# Altium schematic sheet Ethernet.SchDoc
size A2
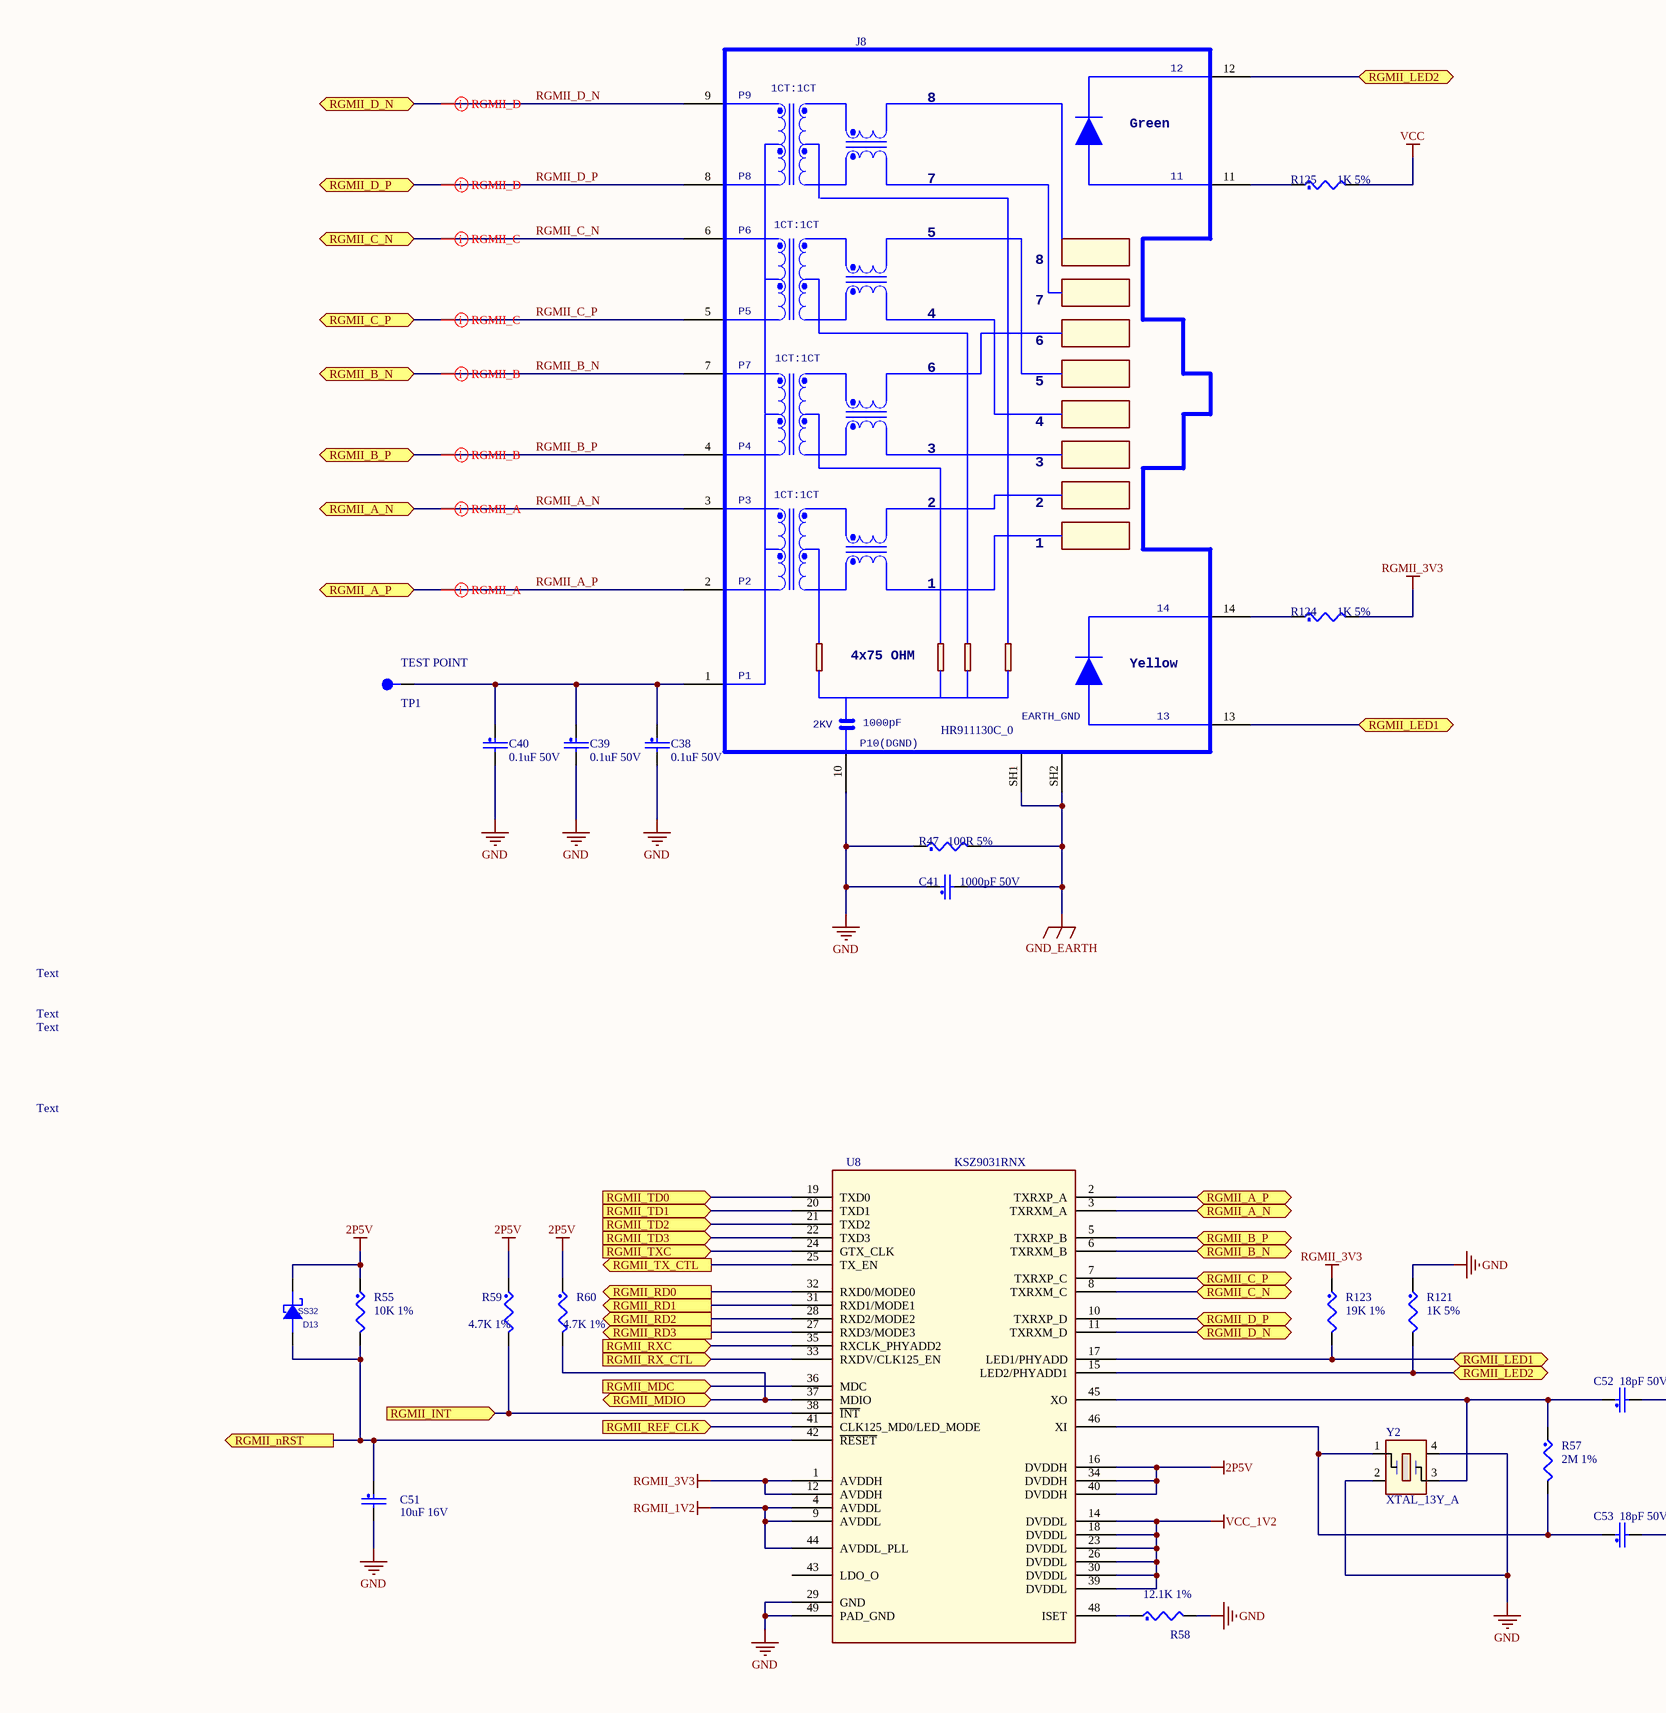
[diagram p0: Ethernet.SchDoc, left]
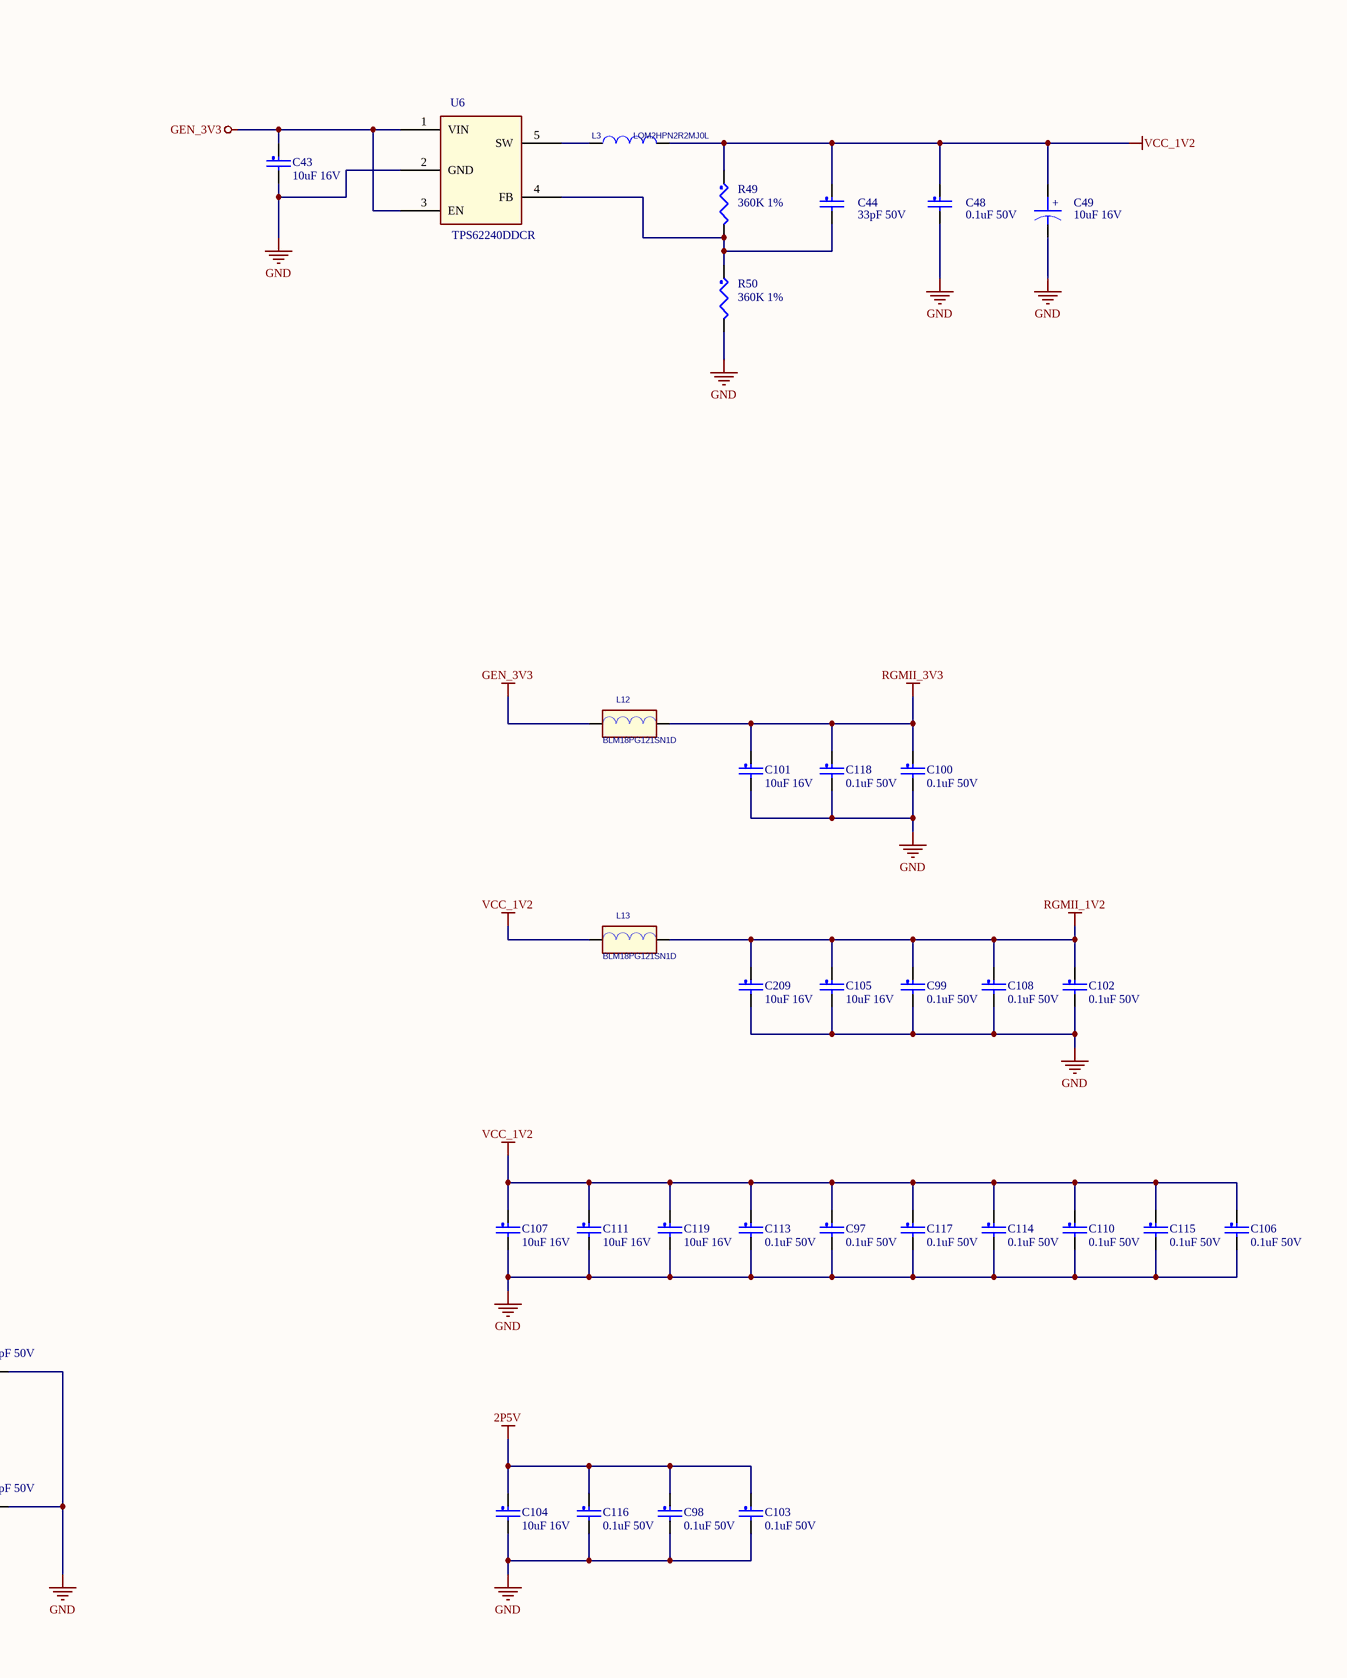
[diagram p1: Ethernet.SchDoc, right]

## Parts
C38  0.1uF 50V  [SC0603]
C39  0.1uF 50V  [SC0603]
C40  0.1uF 50V  [SC0603]
C41  1000pF 50V  [SC0603]
C43  10uF 16V  [SC0805]
C44  33pF 50V  [SC0603]
C48  0.1uF 50V  [SC0603]
C49  10uF 16V  [SC0805]
C51  10uF 16V  [SC0805]
C52  18pF 50V  [SC0603]
C53  18pF 50V  [SC0603]
C97  0.1uF 50V  [SC0603]
C98  0.1uF 50V  [SC0603]
C99  0.1uF 50V  [SC0603]
C100  0.1uF 50V  [SC0603]
C101  10uF 16V  [SC0805]
C102  0.1uF 50V  [SC0603]
C103  0.1uF 50V  [SC0603]
C104  10uF 16V  [SC0805]
C105  10uF 16V  [SC0805]
C106  0.1uF 50V  [SC0603]
C107  10uF 16V  [SC0805]
C108  0.1uF 50V  [SC0603]
C110  0.1uF 50V  [SC0603]
C111  10uF 16V  [SC0805]
C113  0.1uF 50V  [SC0805]
C114  0.1uF 50V  [SC0603]
C115  0.1uF 50V  [SC0603]
C116  0.1uF 50V  [SC0603]
C117  0.1uF 50V  [SC0603]
C118  0.1uF 50V  [SC0603]
C119  10uF 16V  [SC0805]
C209  10uF 16V  [SC0805]
D13  SS32  [DO-214AA]
J8  HR911130C_0  [RJ45-HANRUN-fixed]
L3  LQM2HPN2R2MJ0L  [SPM2P5X2]
L12  BLM18PG121SN1D  [SFB0603]
L13  BLM18PG121SN1D  [SFB0603]
R47  100R 5%  [SR0603]
R49  360K 1%  [SR0603]
R50  360K 1%  [SR0603]
R55  10K 1%  [SR0603]
R57  2M 1%  [SR0603]
R58  12.1K 1%  [SR0603]
R59  4.7K 1%  [SR0603]
R60  4.7K 1%  [SR0603]
R121  1K 5%  [SR0603]
R123  19K 1%  [SR0603]
R124  1K 5%  [SR0603]
R125  1K 5%  [SR0603]
TP1  TEST POINT  [TP_C]
U6  TPS62240DDCR  [SOT23-5]
U8  KSZ9031RNX  [QFN48-0P5-7X7]
Y2  XTAL_13Y_A  [SCRY4-3P2X2P5]

## Ports
RGMII_A_N (bidir), RGMII_A_P (bidir), RGMII_B_N (bidir), RGMII_B_P (bidir), RGMII_C_N (bidir), RGMII_C_P (bidir), RGMII_D_N (bidir), RGMII_D_P (bidir), RGMII_INT (in), RGMII_LED1 (bidir), RGMII_LED2 (bidir), RGMII_MDC (in), RGMII_MDIO (bidir), RGMII_nRST (out), RGMII_RD0 (out), RGMII_RD1 (out), RGMII_RD2 (out), RGMII_RD3 (out), RGMII_REF_CLK (in), RGMII_RX_CTL (in), RGMII_RXC (in), RGMII_TD0 (in), RGMII_TD1 (in), RGMII_TD2 (in), RGMII_TD3 (in), RGMII_TX_CTL (out), RGMII_TXC (in)

## Nets
2P5V: C98.1 C103.1 C104.1 C116.1 D13.2(CATHODE) R55.1 R59.1 R60.1 U8.16(DVDDH) U8.34(DVDDH) U8.40(DVDDH)
GEN_3V3: C43.1 L12.1 U6.1(VIN) U6.3(EN)
GND: C38.2 C39.2 C40.2 C41.1 C43.2 C48.2 C49.2 C51.2 C52.2 C53.2 C97.2 C98.2 C99.2 C100.2 C101.2 C102.2 C103.2 C104.2 C105.2 C106.2 C107.2 C108.2 C110.2 C111.2 C113.2 C114.2 C115.2 C116.2 C117.2 C118.2 C119.2 C209.2 J8.10(GND) R47.1 R50.2 R58.2 R121.1 U6.2(GND) U8.29(GND) U8.49(PAD_GND) Y2.2 Y2.4
GND_EARTH: C41.2 J8.SH1 J8.SH2 R47.2
NC: U8.13(NC) U8.47(NC)
RGMII_1V2: C99.1 C102.1 C105.1 C108.1 C209.1 L13.2 U8.4(AVDDL) U8.9(AVDDL) U8.44(AVDDL_PLL)
RGMII_3V3: C100.1 C101.1 C118.1 L12.2 R123.1 R124.2 U8.1(AVDDH) U8.12(AVDDH)
VCC: R125.2
VCC_1V2: C44.1 C48.1 C49.1 C97.1 C106.1 C107.1 C110.1 C111.1 C113.1 C114.1 C115.1 C117.1 C119.1 L3.2 L13.1 R49.1 U8.14(DVDDL) U8.18(DVDDL) U8.23(DVDDL) U8.26(DVDDL) U8.30(DVDDL) U8.39(DVDDL)
RGMII_A_N: J8.3(MDI_0-) U8.3(TXRXM_A) ; port RGMII_A_N
RGMII_A_P: J8.2(MDI_0+) U8.2(TXRXP_A) ; port RGMII_A_P
RGMII_B_N: J8.7(MDI_1-) U8.6(TXRXM_B) ; port RGMII_B_N
RGMII_B_P: J8.4(MDI_1+) U8.5(TXRXP_B) ; port RGMII_B_P
RGMII_C_N: J8.6(MDI_2-) U8.8(TXRXM_C) ; port RGMII_C_N
RGMII_C_P: J8.5(MDI_2+) U8.7(TXRXP_C) ; port RGMII_C_P
RGMII_D_N: J8.9(MDI_3-) U8.11(TXRXM_D) ; port RGMII_D_N
RGMII_D_P: J8.8(MDI_3+) U8.10(TXRXP_D) ; port RGMII_D_P
RGMII_INT: R59.2 U8.38(~{INT}) ; port RGMII_INT
RGMII_LED1: J8.13(Y_LED-) R123.2 U8.17(LED1/PHYADD) ; port RGMII_LED1
RGMII_LED2: J8.12(G_LED-) R121.2 U8.15(LED2/PHYADD1) ; port RGMII_LED2
RGMII_MDC: U8.36(MDC) ; port RGMII_MDC
RGMII_MDIO: R60.2 U8.37(MDIO) ; port RGMII_MDIO
RGMII_nRST: C51.1 D13.1(ANODE) R55.2 U8.42(~{RESET}) ; port RGMII_nRST
RGMII_RD0: U8.32(RXD0/MODE0) ; port RGMII_RD0
RGMII_RD1: U8.31(RXD1/MODE1) ; port RGMII_RD1
RGMII_RD2: U8.28(RXD2/MODE2) ; port RGMII_RD2
RGMII_RD3: U8.27(RXD3/MODE3) ; port RGMII_RD3
RGMII_REF_CLK: U8.41(CLK125_MD0/LED_MODE) ; port RGMII_REF_CLK
RGMII_RX_CTL: U8.33(RXDV/CLK125_EN) ; port RGMII_RX_CTL
RGMII_RXC: U8.35(RXCLK_PHYADD2) ; port RGMII_RXC
RGMII_TD0: U8.19(TXD0) ; port RGMII_TD0
RGMII_TD1: U8.20(TXD1) ; port RGMII_TD1
RGMII_TD2: U8.21(TXD2) ; port RGMII_TD2
RGMII_TD3: U8.22(TXD3) ; port RGMII_TD3
RGMII_TX_CTL: U8.25(TX_EN) ; port RGMII_TX_CTL
RGMII_TXC: U8.24(GTX_CLK) ; port RGMII_TXC
NetC38_1: C38.1 C39.1 C40.1 J8.1(CT1/2/3/4) TP1.1
NetC44_2: C44.2 R49.2 R50.1 U6.4(FB)
NetC52_1: C52.1 R57.1 U8.45(XO) Y2.3
NetC53_1: C53.1 R57.2 U8.46(XI) Y2.1
NetJ8_11: J8.11(G_LED+) R125.1
NetJ8_14: J8.14(Y_LED+) R124.1
NetL3_1: L3.1 U6.5(SW)
NetR58_1: R58.1 U8.48(ISET)

Not connected (* = marked no-connect by the designer): U8 43(LDO_O)

## Layout directives
differential pair: RGMII_A_N, RGMII_A_P, RGMII_B_N, RGMII_B_P, RGMII_C_N, RGMII_C_P, RGMII_D_N, RGMII_D_P

## Notes on the sheet
- Text
- (in symbol CAPACITOR POL) +
- (in symbol HR911130C_0) 1CT:1CT; P9; Green; P8; P6; P5; P7; P4; P3; P2; 4x75 OHM; Yellow; P1; EARTH_GND; 2KV; 1000pF; P10(DGND)

## Library data of the parts
C38-C41 C43 C44 C48 C51-C53 C97-C108 C110 C111 C113-C119 C209 = CAP_NP: CLASS: DISCRETE
C49 = CAPACITOR POL
D13 = DIODE SCHOTTKY
L3 = INDUCTOR
L12 L13 = BEAD
R47 R49 R50 R55 R57-R60 R121 R123-R125 = RES: CLASS: DISCRETE
TP1 = TP
Y2 = XTAL_13Y_A: CLASS: IC